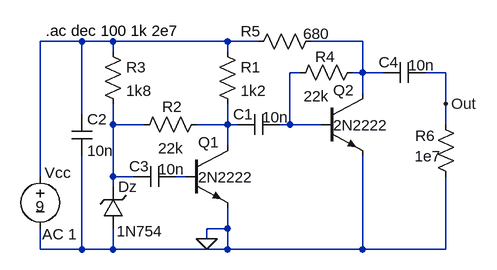
[diagram p0: schematic 2Q_HfNoiseGen.asc]
2Q_HfNoiseGen.asc, the LTspice schematic file:
Version 4
SHEET 1 880 680
WIRE -80 -48 -144 -48
WIRE -32 -48 -80 -48
WIRE 144 -48 -32 -48
WIRE 192 -48 144 -48
WIRE 352 -48 272 -48
WIRE -32 -32 -32 -48
WIRE 144 -32 144 -48
WIRE 256 0 240 0
WIRE 352 0 352 -48
WIRE 352 0 336 0
WIRE 384 0 352 0
WIRE 480 0 448 0
WIRE 352 32 352 0
WIRE 480 48 480 0
WIRE -80 64 -80 -48
WIRE -32 80 -32 48
WIRE 16 80 -32 80
WIRE 144 80 144 48
WIRE 144 80 96 80
WIRE 160 80 144 80
WIRE 240 80 240 0
WIRE 240 80 224 80
WIRE 288 80 240 80
WIRE 480 80 480 48
WIRE 144 112 144 80
WIRE -144 160 -144 -48
WIRE -32 160 -32 80
WIRE 0 160 -32 160
WIRE 80 160 64 160
WIRE -32 176 -32 160
WIRE 144 240 144 208
WIRE 144 240 112 240
WIRE 112 256 112 240
WIRE -144 272 -144 240
WIRE -80 272 -80 128
WIRE -80 272 -144 272
WIRE -32 272 -32 240
WIRE -32 272 -80 272
WIRE 144 272 144 240
WIRE 144 272 -32 272
WIRE 352 272 352 128
WIRE 352 272 144 272
WIRE 480 272 480 160
WIRE 480 272 352 272
FLAG 112 256 0
FLAG 480 48 Out
SYMBOL npn2 80 112 R0
WINDOW 0 19 -5 Left 0
WINDOW 3 19 49 Left 0
SYMATTR InstName Q1
SYMATTR Value 2N2222
SYMBOL res 128 -48 R0
SYMATTR InstName R1
SYMATTR Value 1k2
SYMBOL res 112 64 R90
WINDOW 0 4 53 VBottom 0
WINDOW 3 37 55 VTop 0
SYMATTR InstName R2
SYMATTR Value 22k
SYMBOL zener -16 240 R180
WINDOW 0 -21 64 Left 0
WINDOW 3 -61 -4 Left 0
SYMATTR InstName Dz
SYMATTR Value 1N754
SYMBOL res -48 -48 R0
SYMATTR InstName R3
SYMATTR Value 1k8
SYMBOL npn2 288 32 R0
WINDOW 0 19 -5 Left 0
WINDOW 3 19 49 Left 0
SYMATTR InstName Q2
SYMATTR Value 2N2222
SYMBOL cap 224 64 R90
WINDOW 0 16 56 VBottom 0
WINDOW 3 -11 6 VTop 0
SYMATTR InstName C1
SYMATTR Value 10n
SYMBOL res 352 -16 R90
WINDOW 0 7 58 VBottom 0
WINDOW 3 37 71 VTop 0
SYMATTR InstName R4
SYMATTR Value 22k
SYMBOL res 288 -64 R90
WINDOW 0 16 108 VBottom 0
WINDOW 3 -11 7 VTop 0
SYMATTR InstName R5
SYMATTR Value 680
SYMBOL voltage -144 144 R0
WINDOW 0 7 10 Left 0
WINDOW 3 -7 62 Left 0
WINDOW 123 3 105 Left 0
WINDOW 39 0 0 Left 0
SYMATTR InstName Vcc
SYMATTR Value 9
SYMATTR Value2 AC 1
SYMBOL cap -96 64 R0
SYMATTR InstName C2
SYMATTR Value 10n
SYMBOL cap 64 144 R90
WINDOW 0 16 56 VBottom 0
WINDOW 3 -11 6 VTop 0
SYMATTR InstName C3
SYMATTR Value 10n
SYMBOL cap 448 -16 R90
WINDOW 0 16 56 VBottom 0
WINDOW 3 -11 6 VTop 0
SYMATTR InstName C4
SYMATTR Value 10n
SYMBOL res 464 64 R0
WINDOW 0 -31 33 Left 0
WINDOW 3 -32 65 Left 0
SYMATTR InstName R6
SYMATTR Value 1e7
TEXT -136 -64 Left 0 !.ac dec 100 1k 2e7

The netlist it stands for:
* 2Q_HfNoiseGen.asc
Q1 N005 N006 0 0 2N2222
R1 N001 N005 1k2
R2 N005 N004 22k
Dz 0 N004 1N754
R3 N001 N004 1k8
Q2 N002 N003 0 0 2N2222
C1 N003 N005 10n
R4 N002 N003 22k
R5 N002 N001 680
Vcc N001 0 9 AC 1
C2 N001 0 10n
C3 N006 N004 10n
C4 Out N002 10n
R6 Out 0 1e7
.model D D
.lib standard.dio
.model NPN NPN
.model PNP PNP
.lib standard.bjt
.ac dec 100 1k 2e7
.backanno
.end